# Altium schematic sheet MainSCH.SchDoc
size A
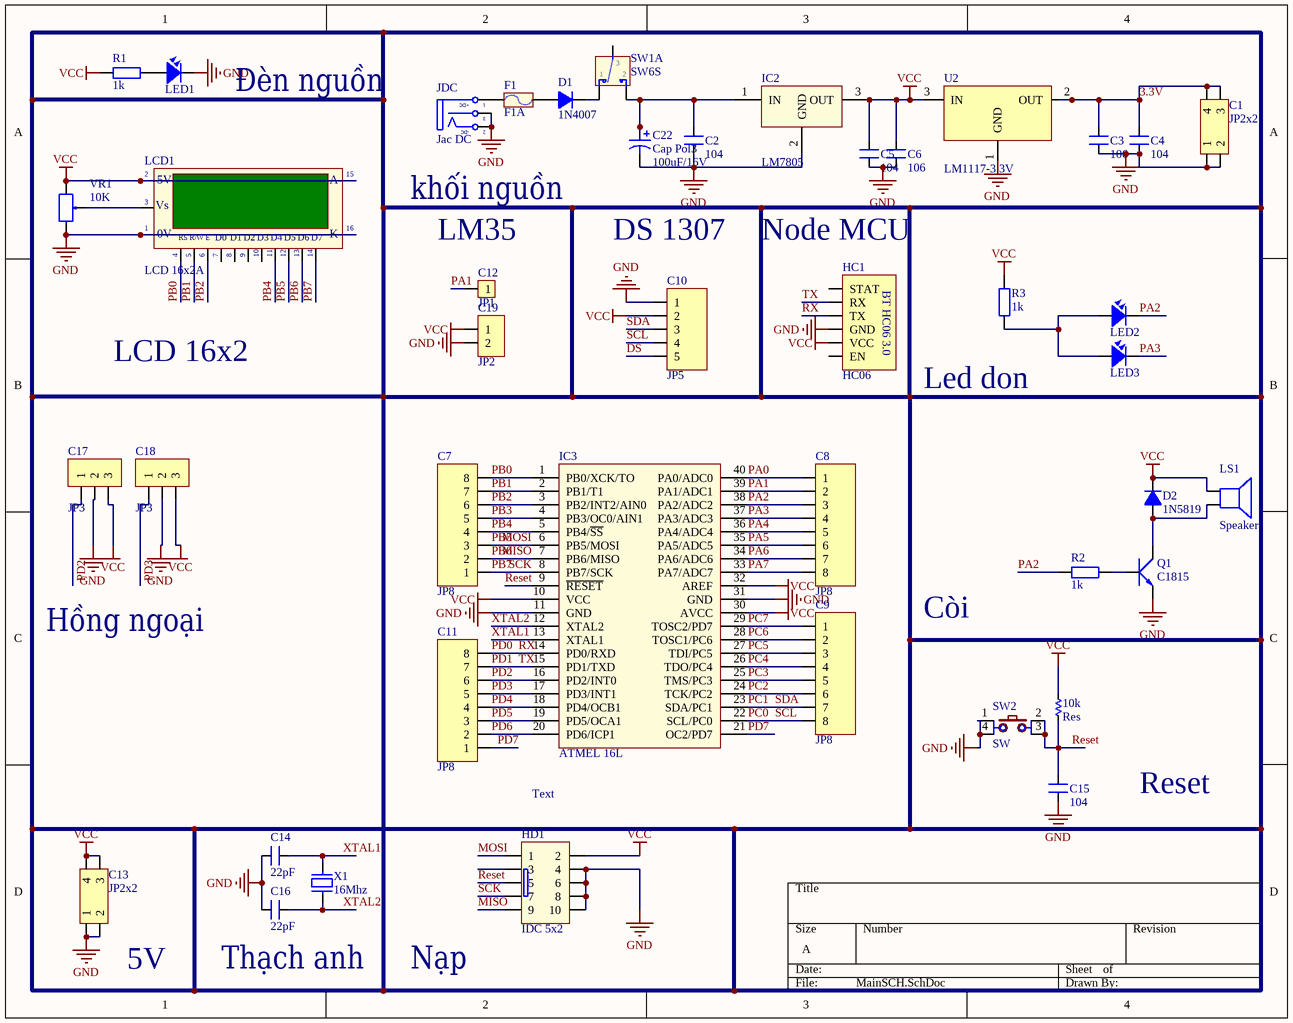
[diagram p0: MainSCH.SchDoc]

## Parts
10k  Res  [RES-1/2W]
C1  JP2x2  [JP2-C2T]
C2  104  [CN2]
C3  106  [CN2]
C4  104  [CN2]
C5  104  [CN2]
C6  106  [CN2]
C7  JP8  [JP8-C1T]
C8  JP8  [JP8-C1T]
C9  JP8  [JP8-C1T]
C10  JP5  [JP5-C1T]
C11  JP8  [JP8-C1T]
C12  JP1  [JP1-D1T]
C13  JP2x2  [JP2-C2T]
C14  22pF  [CN1]
C15  104  [CN2]
C16  22pF  [CN1]
C17  JP3  [JP3-C1T]
C18  JP3  [JP3-C1T]
C19  JP2  [JP2-D1T]
C22  Cap Pol3  value 100uF/16V  [CP2/5]
D1  1N4007  [D1A]
D2  1N5819  [D5A]
F1  F1A  [Fuse]
HC1  HC06  [HC06]
HD1  IDC 5x2  [IDC10]
IC2  LM7805  [QTO-220]
IC3  ATMEL 16L  [DIP40/W0.6]
JDC  Jac DC  [DC-IN]
LCD1  LCD 16x2A  [JP16-C1T]
LED1  LED  [LED-3]  (value not drawn)
LED2  LED  [LED-3MM-YELLOW]  (value not drawn)
LED3  LED  [LED-3]  (value not drawn)
LS1  Speaker  [SPEAKER]
Q1  C1815  [QTO-92]
R1  1k  [R1/4W]
R2  1k  [R1/4W]
R3  1k  [R1/4W]
SW1  SW6S  [SW6]  (part A of 2)
SW2  SW  [SW2-DIP]
U2  LM1117-3.3V  [TO220-123]
VR1  10K  [VR]
X1  16Mhz  [XT2]

## Nets
GND: C1.1 C1.2 C2.1 C3.1 C4.1 C5.1 C6.1 C10.1 C13.1 C13.2 C14.1 C15.2 C16.1 C17.2 C18.2 C19.2 C22.2 HC1.4(GND) HD1.4 HD1.6 HD1.8 HD1.10 IC2.2(GND) IC3.11(GND) IC3.31(GND) JDC.2(TN) JDC.3(S) LCD1.1(GND) LCD1.16(K) LED1.2 Q1.1(E) SW2.1 SW2.4 U2.1(GND) VR1.3
VCC: 10k.1 C5.2 C6.2 C10.2 C13.3 C13.4 C17.3 C18.3 C19.1 D2.2(K) HC1.5(VCC) HD1.2 IC2.3(OUT) IC3.10(VCC) IC3.30(AVCC) IC3.32(AREF) LCD1.2(VDD) LCD1.15(A) LS1.1 R1.1 R3.2 U2.3(IN) VR1.1
3.3V: C1.3 C1.4 C3.2 C4.2 U2.2(OUT)
DS: C10.5
MISO: C7.2 HD1.9 IC3.7(PB6/MISO) LCD1.13(D6)  [also labelled PB6]
MOSI: C7.3 HD1.1 IC3.6(PB5/MOSI) LCD1.12(D5)  [also labelled PB5]
PA0: C8.1 IC3.40(PA0/ADC0)
PA1: C8.2 C12.1 IC3.39(PA1/ADC1)
PA2: C8.3 IC3.38(PA2/ADC2) LED2.2 R2.1
PA3: C8.4 IC3.37(PA3/ADC3) LED3.2
PA4: C8.5 IC3.36(PA4/ADC4)
PA5: C8.6 IC3.35(PA5/ADC5)
PA6: C8.7 IC3.34(PA6/ADC6)
PA7: C8.8 IC3.33(PA7/ADC7)
PB0: C7.8 IC3.1(PB0/XCK/TO) LCD1.4(RS)
PB1: C7.7 IC3.2(PB1/T1) LCD1.5(R/~{W})
PB2: C7.6 IC3.3(PB2/INT2/AIN0) LCD1.6(~{EN})
PB3: C7.5 IC3.4(PB3/OC0/AIN1)
PB4: C7.4 IC3.5(PB4/~{SS}) LCD1.11(D4)
PB7: C7.1 HD1.7 IC3.8(PB7/SCK) LCD1.14(D7)  [also labelled SCK]
PC0: C9.8 C10.4 IC3.22(SCL/PC0)  [also labelled SCL]
PC1: C9.7 C10.3 IC3.23(SDA/PC1)  [also labelled SDA]
PC2: C9.6 IC3.24(TCK/PC2)
PC3: C9.5 IC3.25(TMS/PC3)
PC4: C9.4 IC3.26(TDO/PC4)
PC5: C9.3 IC3.27(TDI/PC5)
PC6: C9.2 IC3.28(TOSC1/PC6)
PC7: C9.1 IC3.29(TOSC2/PD7)
PD0: C11.8 HC1.3(TX) IC3.14(PD0/RXD)  [also labelled RX]
PD1: C11.7 HC1.2(RX) IC3.15(PD1/TXD)  [also labelled TX]
PD2: C11.6 C17.1 IC3.16(PD2/INT0)
PD3: C11.5 C18.1 IC3.17(PD3/INT1)
PD4: C11.4 IC3.18(PD4/OCB1)
PD5: C11.3 IC3.19(PD5/OCA1)
PD6: C11.2 IC3.20(PD6/ICP1)
PD7: C11.1 IC3.21(OC2/PD7)
Reset: 10k.2 C15.1 HD1.5 IC3.9(~{RESET}) SW2.2 SW2.3
XTAL1: C14.2 IC3.13(XTAL1) X1.1
XTAL2: C16.2 IC3.12(XTAL2) X1.2
NetC2_2: C2.2 C22.1 IC2.1(IN) SW1.2
NetD1_1: D1.1(A) F1.2
NetD1_2: D1.2(K) SW1.1
NetD2_1: D2.1(A) LS1.2 Q1.2(C)
NetF1_1: F1.1 JDC.1(T)
NetLCD1_3: LCD1.3(VEE) VR1.2
NetLED1_1: LED1.1 R1.2
NetLED2_1: LED2.1 LED3.1 R3.1
NetQ1_3: Q1.3(B) R2.2

Not connected (* = marked no-connect by the designer): HC1 1(STAT) 6(EN); HD1 3; LCD1 7(D0) 8(D1) 9(D2) 10(D3); SW1 3

## Notes on the sheet
- Đèn nguồn
- khối nguồn
- (near C12) LM35
- DS 1307
- Node MCU
- LCD 16x2
- (near R3) Led don
- Hồng ngoại
- Còi
- Text
- Reset
- (near C13) 5V
- Thạch anh
- Nạp
- (in symbol DCIN) +DC; -DC
- (in symbol HC06) BT HC06 3.0
- (in symbol LCD16x2A) 5V; Vs; |; 0V; R/W; E

## Library data of the parts
10k = Res: Manufacturer: Generic Components; Class: Passive; SubClass: R; Published: 08/06/2000; Publisher: Altium Hobart Technology Centre
C1 C13 = JP2x2: WR-PHD 2.54 mm Dual Socket Header; Manufacturer: W¨¹rth Elektronik eiSos GmbH; partNo: 61300421821; ComponentLink1 Description: Manufacturer; ComponentLink2 Description: Datasheet; NoPins: 04; Created Date: 29 March 2013; ComponentLink1URL: http://www.we-online.com; ComponentLink2URL: http://katalog.we-online.de/em/datasheet/6130xx21821.pdf; Created by: Karrer Zheng
C2-C6 C15 = CN2: Cap np 104 => 105pF; Value: 0.1uF
C7-C9 C11 = JP8: WR-PHD 2.54 mm Angled Socket Header; Manufacturer: W¨¹rth Elektronik eiSos GmbH; partNo: 613008143121; ComponentLink1 Description: Manufacturer; ComponentLink2 Description: Datasheet; NoPins: 08; Created Date: 29 March 2013; ComponentLink1URL: http://www.we-online.com; ComponentLink2URL: http://katalog.we-online.de/em/datasheet/6130xx143121.pdf; Created by: Karrer Zheng
C10 = JP5: WR-PHD 2.54 mm Angled Socket Header; Manufacturer: W¨¹rth Elektronik eiSos GmbH; partNo: 613005143121; ComponentLink1 Description: Manufacturer; ComponentLink2 Description: Datasheet; NoPins: 05; Created Date: 29 March 2013; ComponentLink1URL: http://www.we-online.com; ComponentLink2URL: http://katalog.we-online.de/em/datasheet/6130xx143121.pdf; Created by: Karrer Zheng
C12 = JP1: WR-PHD 2.54 mm Angled Socket Header; Manufacturer: W¨¹rth Elektronik eiSos GmbH; partNo: 613002143121; ComponentLink1 Description: Manufacturer; ComponentLink2 Description: Datasheet; NoPins: 02; Created Date: 29 March 2013; ComponentLink1URL: http://www.we-online.com; ComponentLink2URL: http://katalog.we-online.de/em/datasheet/6130xx143121.pdf; Created by: Karrer Zheng
C14 C16 = CN1: Cap np  1pF - 472pF; Value: 100pF
C17 C18 = JP3: WR-PHD 2.54 mm Angled Socket Header; Manufacturer: W¨¹rth Elektronik eiSos GmbH; partNo: 613003143121; ComponentLink1 Description: Manufacturer; ComponentLink2 Description: Datasheet; NoPins: 03; Created Date: 29 March 2013; ComponentLink1URL: http://www.we-online.com; ComponentLink2URL: http://katalog.we-online.de/em/datasheet/6130xx143121.pdf; Created by: Karrer Zheng
C19 = JP2: WR-PHD 2.54 mm Angled Socket Header; Manufacturer: W¨¹rth Elektronik eiSos GmbH; partNo: 613002143121; ComponentLink1 Description: Manufacturer; ComponentLink2 Description: Datasheet; NoPins: 02; Created Date: 29 March 2013; ComponentLink1URL: http://www.we-online.com; ComponentLink2URL: http://katalog.we-online.de/em/datasheet/6130xx143121.pdf; Created by: Karrer Zheng
C22 = Cap Pol3: Polarized Capacitor (Surface Mount); VALUE: C?; LatestRevisionDate: 17-Jul-2002; LatestRevisionNote: Re-released for DXP Platform.; PackageReference: C0805; Publisher: Altium Limited
D1 = D1A: Diode 1A; Value: 1N4007
D2 = D5A: Diode 5A; Value: 1N5408
F1 = Fuse: Designed by: VanDungEvn; Value: Fuse
HC1 = HC06: Manufacturer: W¨¹rth Elektronik eiSos GmbH; partNo: 613004143121; ComponentLink1 Description: Manufacturer; ComponentLink2 Description: Datasheet; NoPins: 04; Created Date: 29 March 2013; ComponentLink1URL: http://www.we-online.com; ComponentLink2URL: http://katalog.we-online.de/em/datasheet/6130xx143121.pdf; Created by: Karrer Zheng
HD1 = IDC 5X2: Value: Header 5x2
IC2 = LM78xx: On ap +, from + 5 to + 24VDC; Value: LM7805
IC3 = Atmega16L: 8-Bit AVR Microcontroller with 16K Bytes of In-System Programmable Flash Memory; Value: Atmega 16L
JDC = DCIN: Jac DC input; Value: Jac DC
LCD1 = LCD16x2A: LCD dipslay 16 char, 2 line; Value: LCD16x2A
LED1-LED3 = LED: LED Single colour Green and Red; Value: LED 3 ly Single Colour
LS1 = Speaker: Loudspeaker; Published: 24-Mar-1999; LatestRevisionDate: 17-Jul-2002; LatestRevisionNote: Re-released for DXP Platform.; PackageReference: PIN2; Publisher: Altium Limited
Q1 = C1815: NPN 600mW, ECB; Value: C1815
R1-R3 = R1/4W: Resistor 1/4W; Value: R1/4W - 1K
SW1 = SW6S: SW-DTDP - 6 Pin; Value: SW6
SW2 = SW4: Switch button 4 pin; Value: Button chip 4 pin
U2 = LM1117: 800mA Low-Dropout Linear Regulator; Creator: Nguyen Ba Bien; Website: http://group3i.net
VR1 = VR: Var Resistor; Value: VR 10K
X1 = XT2: Crystal For all Crystal 2pin.; Value: 4Mhz